# EAGLE design CellarRemote (EAGLE 7.2.0)
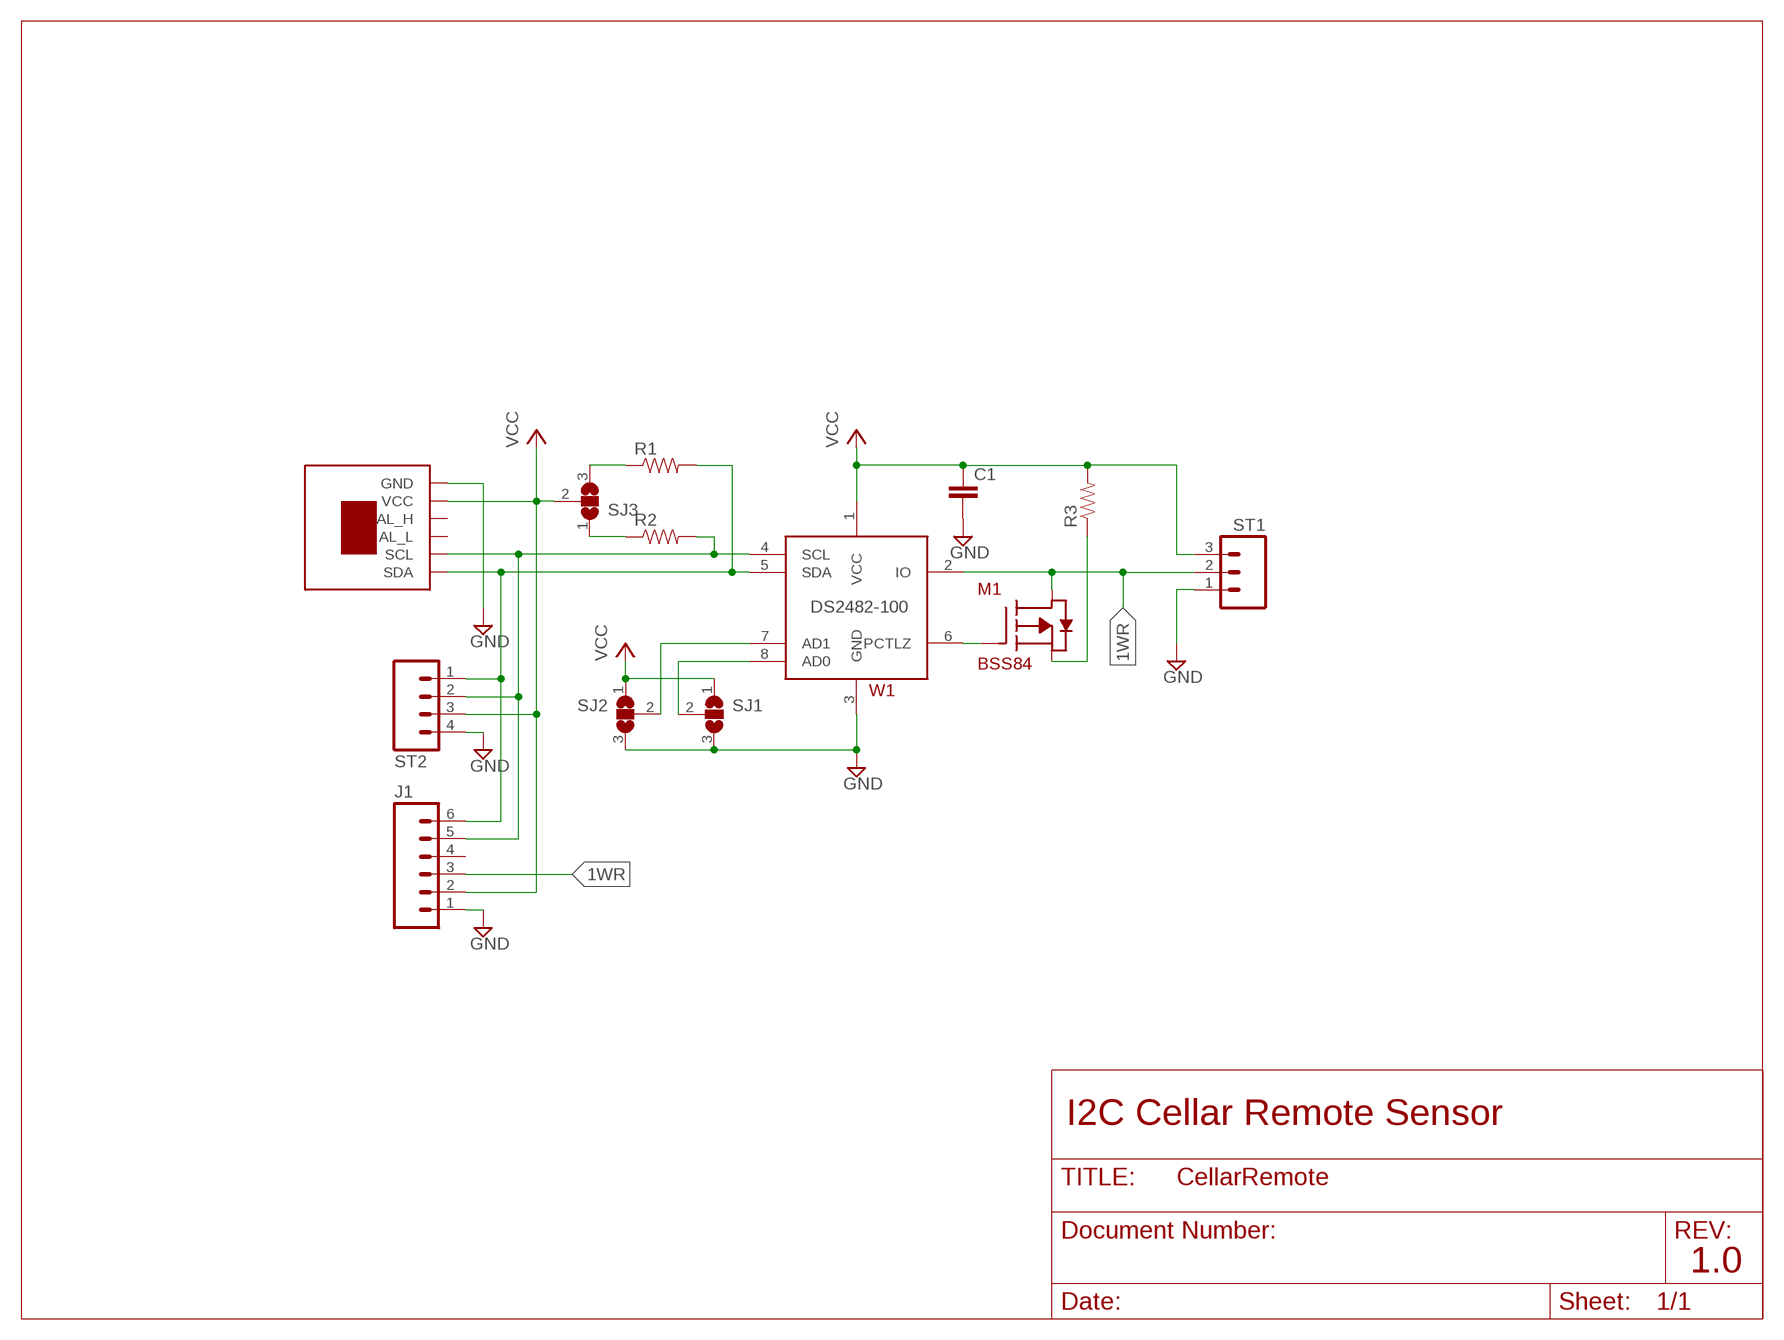
[diagram p0: schematic, sheet 1]

## Parts
C1  CAP0603-CAP  [0603-CAP]
J1  M06SILK_FEMALE_PTH  [1X06]
M1  BSS84  [SOT-23]
R1  RESISTOR0603  [0603-RES]
R2  RESISTOR0603  [0603-RES]
R3  RESISTORPTH-1/4W  [AXIAL-0.4]
SF_HIH  SPARKFUN_HIH6130  [SPARKFUN_HIH6130]
SJ1  SJ2W  [SJ_2]
SJ2  SJ2W  [SJ_2]
SJ3  SJ2W  [SJ_2]
ST1  SCREWTERM_3  [SCREWTERM_0.2X3]
ST2  SCREWTERM_4  [SCREWTERM_0.2X4]
W1  DS2482-100  [SOIC8]

## Nets
1WR: J1.3 M1.3 ST1.2 W1.2(IO)
AD0: SJ1.2 W1.8(AD0)
AD1: SJ2.2 W1.7(AD1)
GND: C1.2 J1.1 SF_HIH.GND SJ1.3 SJ2.3 ST1.1 ST2.4 W1.3(GND)
N$1: M1.1 W1.6(PCTLZ)
N$2: R1.1 SJ3.3
N$3: R2.1 SJ3.1
N$10: M1.2 R3.P$1
SCL: J1.5 R2.2 SF_HIH.SCL ST2.2 W1.4(SCL)
SDA: J1.6 R1.2 SF_HIH.SDA ST2.1 W1.5(SDA)
VCC: C1.1 J1.2 R3.P$2 SF_HIH.VCC SJ1.1 SJ2.1 SJ3.2 ST1.3 ST2.3 W1.1(VCC)
Unconnected: J1.4 SF_HIH.AL_H SF_HIH.AL_L

## Notes on the sheet
- I2C Cellar Remote Sensor
- 1.0

## Library data of the parts
C1 = SparkFun-Capacitors:CAP: Capacitor Standard 0603 ceramic capacitor, and 0.1" leaded capacitor.
J1 = SparkFun-Connectors:M06: Header 6 Standard 6-pin 0.1" header. Use with straight break away headers (SKU : PRT-00116), right angle break away headers (PRT-00553), swiss pins (PRT-00743), machine pins (PRT-00117), and female headers (PRT-00115). Molex polarized connector foot print use with SKU : PRT-08094 with associated crimp pins and housings. NOTES ON THE VARIANTS LOCK and LOCK_LONGPADS... This footprint was designed to help hold the alignment of a through-hole component (i.e. 6-pin header) while soldering it into place. You may notice that each hole has been shifted either up or down by 0.005 of an inch from it's more standard position (which is a perfectly straight line). This slight alteration caused the pins (the squares in the middle) to touch the edges of the holes. Because they are alternating, it causes a "brace" to hold the component in place. 0.005 has proven to be the perfect amount of "off-center" position when using our standard breakaway headers. Although looks a little odd when you look at the bare footprint, once you have a header in there, the alteration is very hard to notice. Also,if you push a header all the way into place, it is covered up entirely on the bottom side. This idea of altering the position of holes to aid alignment will be further integrated into the Sparkfun Library for other footprints. It can help hold any component with 3 or more connection pins.; PROD_ID: CONN-08437
M1 = Puffin:BSS84: BSS84 P-Channel Enhancement Mode Field-Effect Transistor
R1-R3 = SparkFun-Resistors:RESISTOR: Resistor Basic schematic elements and footprints for 0603, 1206, and PTH resistors.
SF_HIH = Puffin:SPARKFUN_HIH6130: SparkFun HIH6130 Breakout Board
SJ1-SJ3 = jumper:SJ2W: SMD solder JUMPER
ST1 = Puffin:SCREWTERM_3
ST2 = Puffin:SCREWTERM_4
W1 = PuffinOneWIre:DS2482-100: DS2482-100 I2C-to-1-Wire® bridge device

## Net classes
0 default: clearance 0.205 mm

## Board
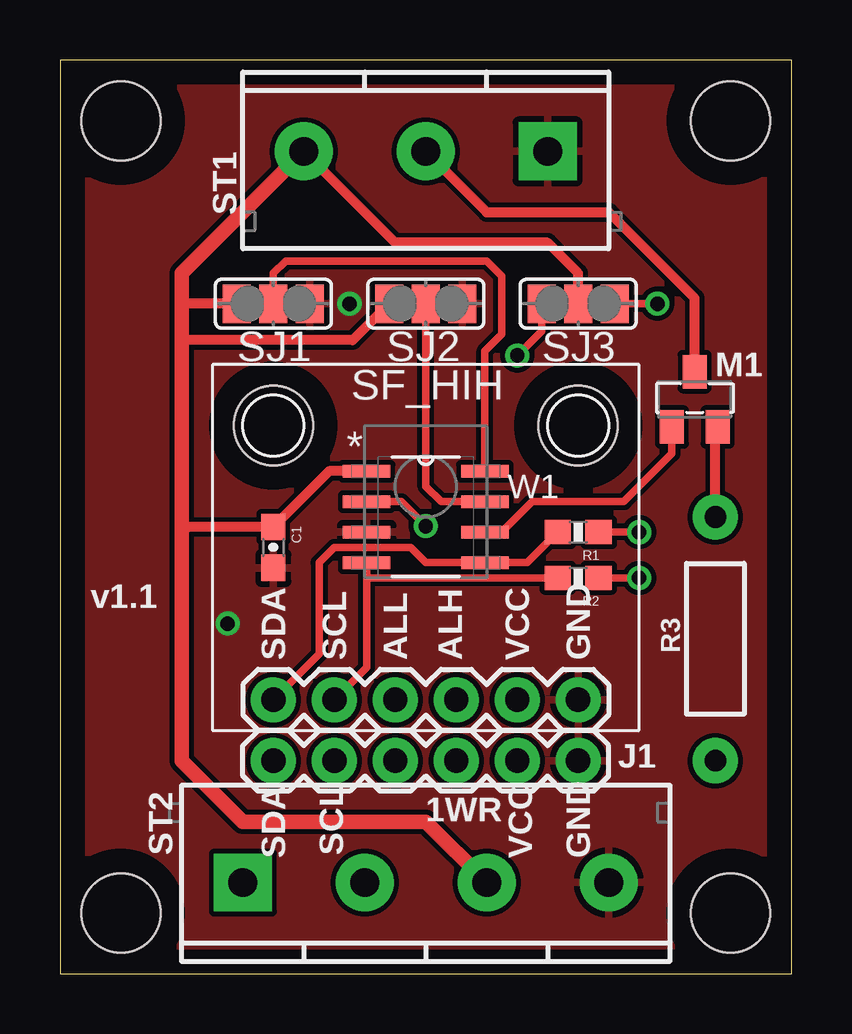
[diagram p1: board, top side]
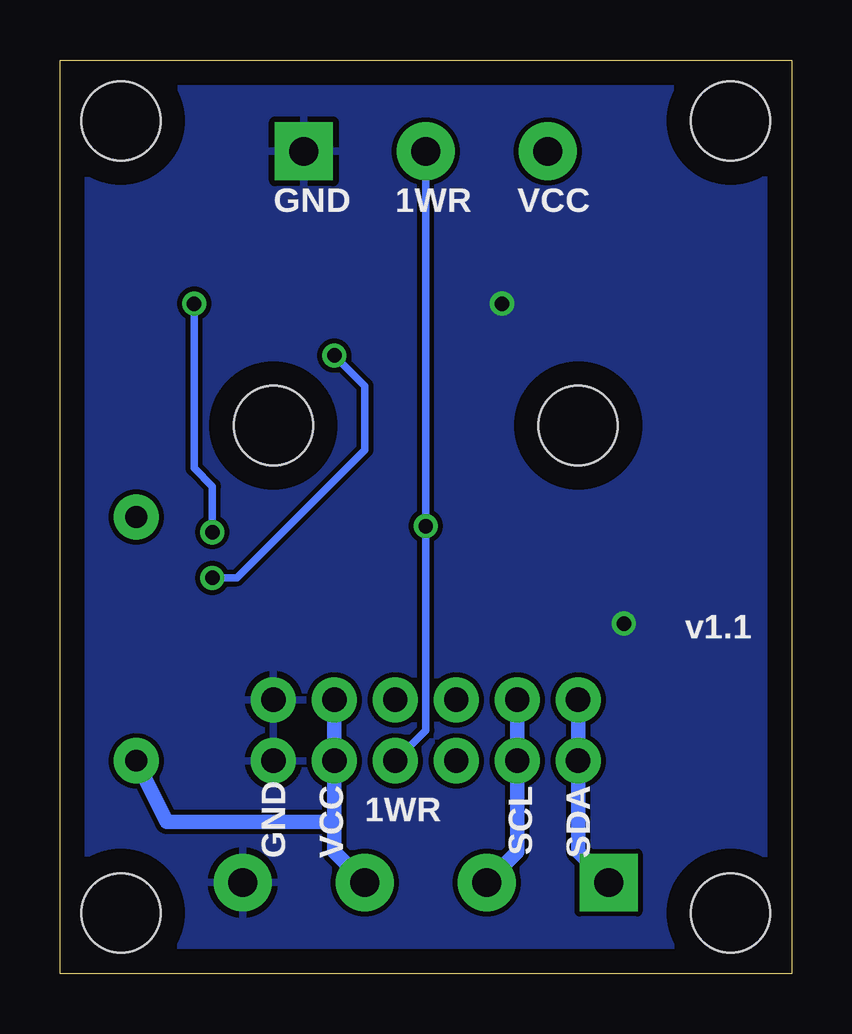
[diagram p2: board, bottom side, seen from below]

Size 30.48 x 38.1 mm. Coordinates in mm from the lower left corner, seen from the top.
Outline: 0,0 30.48,0 30.48,38.1 0,38.1 0,0
Copper layers (1*16): Top 0.035mm / dielectric 1.5mm / Bottom 0.035mm
Design rules "default": minimum track width 10mil, minimum drill 24mil, track to track 8mil, track to pad 8mil, pad to pad 8mil, via to via 8mil, smd to smd 8mil, copper to edge 40mil, drill to drill 8mil, minimum pad ring 10mil, minimum via ring 8mil, stop-mask expansion 4mil, vias tented up to drill 0mil, thermal gap 10mil

### Footprints (pad centres in the part's own frame; a part is rotated, then mirrored left to right if it is on the bottom)
0603-CAP = smd 1.1 x 1: 1 -0.85,0; 2 0.85,0
1X06 = drill 1.016 pad 1.88: 1 0,0; 2 2.54,0; 3 5.08,0; 4 7.62,0; 5 10.16,0; 6 12.7,0
SOT-23 = smd 1 x 1.4: 1 -0.92,-1.2; 2 0.98,-1.2; 3 0.03,1.1
0603-RES = smd 1.1 x 1: 1 -0.85,0; 2 0.85,0
AXIAL-0.4 = drill 0.9 pad 1.88: P$1 -5.08,0; P$2 5.08,0
SPARKFUN_HIH6130 = drill 1.016 pad 1.88: AL_H 1.27,0; AL_L -1.27,0; GND 6.35,0; SCL -3.81,0; SDA -6.35,0; VCC 3.81,0
SJ_2 = smd 1.168 x 1.6: 1 -1.524,0; 2 0,0; 3 1.524,0
SCREWTERM_0.2X3 = drill 1.2 pad 2.413 square: 1 0,0 | drill 1.2 pad 2.413: 2 5.08,0; 3 10.16,0
SCREWTERM_0.2X4 = drill 1.2 pad 2.413 square: 1 0,0 | drill 1.2 pad 2.413: 2 5.08,0; 3 10.16,0; 4 15.24,0
STAND-OFF = hole 3.302: 0,0
SOIC8 = smd 1.981 x 0.533: 1 -2.464,1.905; 2 -2.464,0.635; 3 -2.464,-0.635; 4 -2.464,-1.905; 5 2.464,-1.905; 6 2.464,-0.635; 7 2.464,0.635; 8 2.464,1.905

### Placement (x,y rotation side)
C1  8.89,17.78 270 top
J1  21.59,8.89 180 top
M1  26.42,24 0 top
R1  21.59,18.41 180 top
R2  21.59,16.51 180 top
R3  27.3,13.97 270 top
SF_HIH  15.24,11.43 0 top
SJ1  8.89,27.94 0 top
SJ2  15.24,27.94 0 top
SJ3  21.59,27.94 0 top
ST1  20.32,34.29 180 top
ST2  7.62,3.81 0 top
U$1  [STAND-OFF]  2.54,2.54 0 top
U$2  [STAND-OFF]  27.94,2.54 0 top
U$3  [STAND-OFF]  27.94,35.56 0 top
U$4  [STAND-OFF]  2.54,35.56 0 top
U$6  [STAND-OFF]  8.89,22.86 0 top
U$7  [STAND-OFF]  21.59,22.86 0 top
W1  15.24,19.05 0 top

### Tracks (layer width: path | path; a pad name or v marks a point on that pad's centre or on a via)
1WR  (via drill 0.6)
  Top 0.305: W1.2 14.22,19.68 v15.24,18.67
  Top 0.406: ST1.2 17.78,31.75 22.86,31.75 26.45,28.16 M1.3
  Bottom 0.305: J1.3 15.24,10.16 v15.24,18.67 ST1.2
AD0
  Top 0.305: W1.8 17.7,25.96 18.41,26.67 18.41,29.08 17.78,29.72 9.4,29.72 8.89,29.21 SJ1.2
AD1
  Top 0.305: W1.7 15.88,19.68 15.24,20.32 SJ2.2
GND  (via drill 0.6)
  other vias: 12.06,27.94 6.99,14.61
  pour Bottom: -0.51,38.61 30.99,38.61 30.99,-0.51 -0.51,-0.51
  pour Top: -0.25,38.35 30.73,38.35 30.73,-0.25 -0.25,-0.25
N$1
  Top 0.305: W1.6 18.41,18.41 19.68,19.68 23.5,19.68 25.5,21.69 M1.1
N$2  (via drill 0.6)
  Top 0.305: 22.86,27.94 SJ3.3 v24.89,27.94 | v24.13,18.41 R1.1
  Bottom 0.305: v24.13,18.41 24.13,20.32 24.89,21.08 v24.89,27.94
N$3  (via drill 0.6)
  Top 0.305: R2.1 v24.13,16.51 | SJ3.1 20.07,26.8 v19.05,25.78
  Bottom 0.305: v24.13,16.51 23.11,16.51 17.78,21.84 17.78,24.51 v19.05,25.78
N$10
  Top 0.406: R3.P$1 27.3,22.71 M1.2
SCL
  Top 0.305: SF_HIH.SCL 12.78,12.78 12.78,16.51 | 12.78,16.51 W1.4 | R2.2 12.78,16.51
  Bottom 0.61: SF_HIH.SCL J1.5 11.43,5.08 ST2.2
SDA
  Top 0.305: R1.2 19.47,17.14 W1.5 15.24,17.14 14.61,17.78 11.43,17.78 10.79,17.14 10.79,13.34 SF_HIH.SDA
  Bottom 0.61: SF_HIH.SDA J1.6 8.89,5.08 ST2.1
VCC
  Top 0.406: SJ1.1 5.08,27.94 | 5.08,18.41 5.29,18.63 C1.1 11.21,20.95 W1.1 | SJ2.1 12.19,26.42 5.08,26.42 | SJ3.2 21.59,29.21 20.32,30.48 13.97,30.48 ST1.3
  Top 0.61: ST1.3 5.08,29.21 5.08,27.94 5.08,26.42 5.08,18.41 5.08,8.89 7.62,6.35 15.24,6.35 ST2.3
  Bottom 0.61: SF_HIH.VCC J1.2 19.05,6.35 | ST2.3 19.05,5.08 19.05,6.35 | R3.P$2 26.04,6.35 19.05,6.35

### Text on the board
tPlace: v1.1 | 1WR | SDA | SCL | VCC | GND
bPlace: VCC | 1WR | GND | v1.1 | 1WR | SDA | SCL | VCC | GND